# EAGLE board smoothieboard-0driver (EAGLE 6.4), part 1 of 2
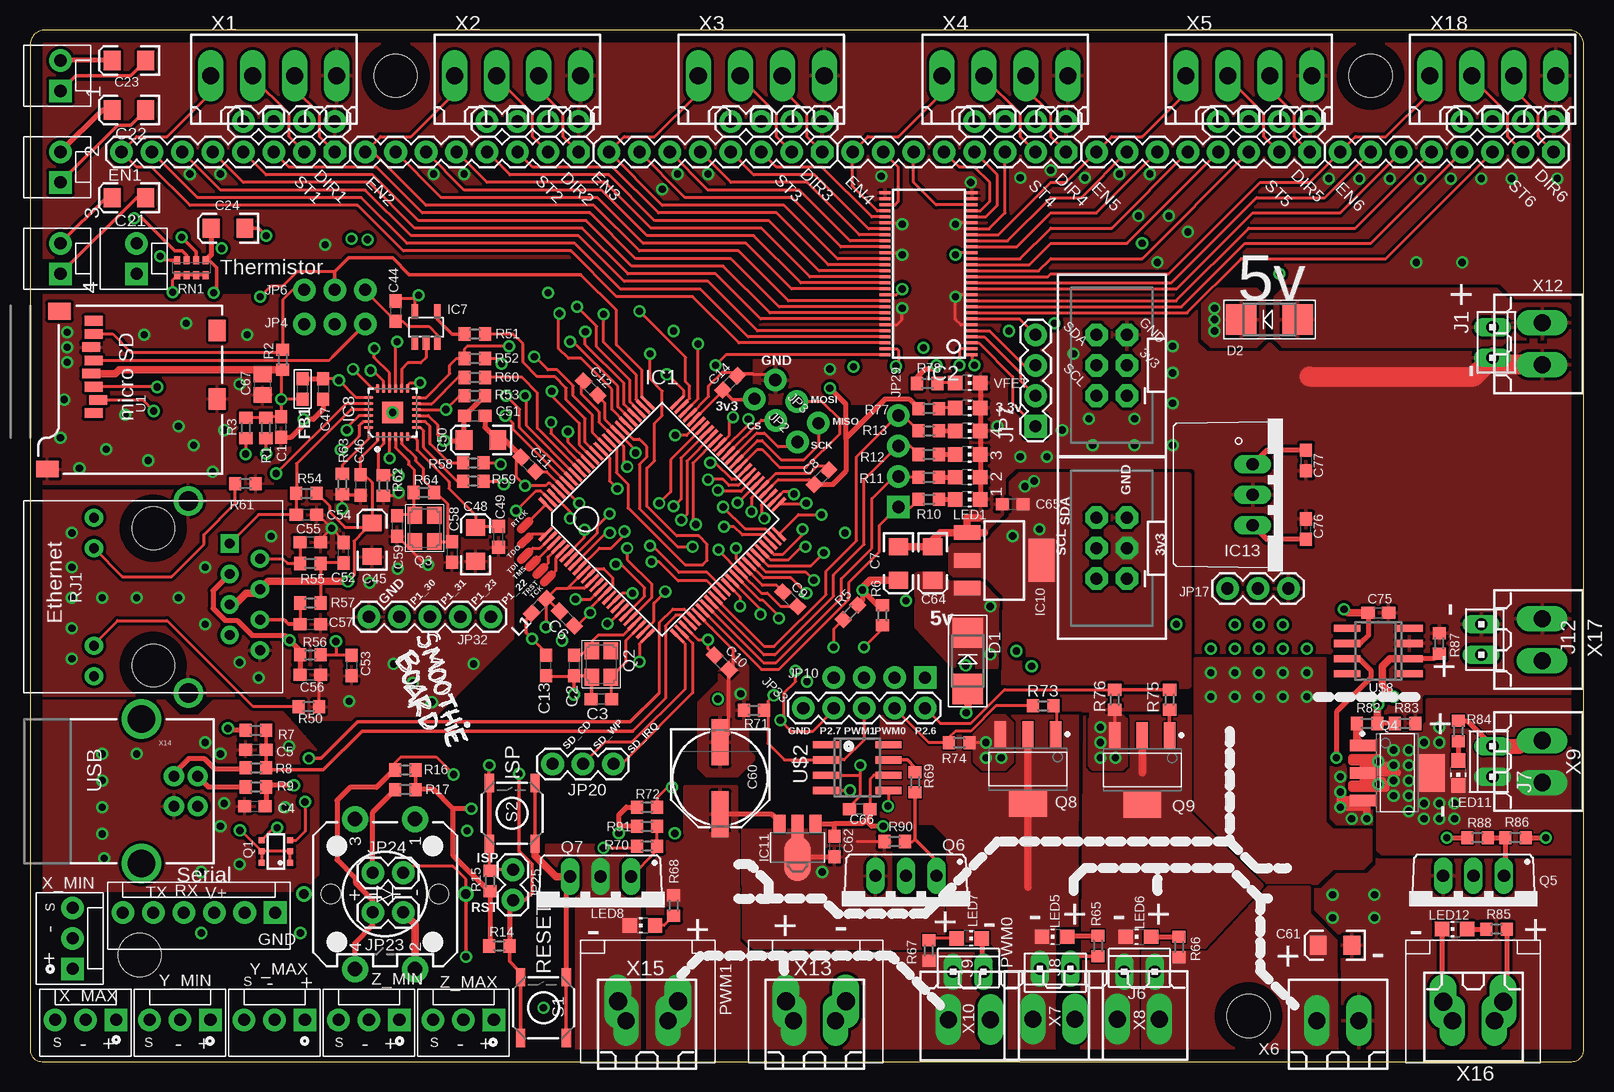
[diagram p4: board, top side]
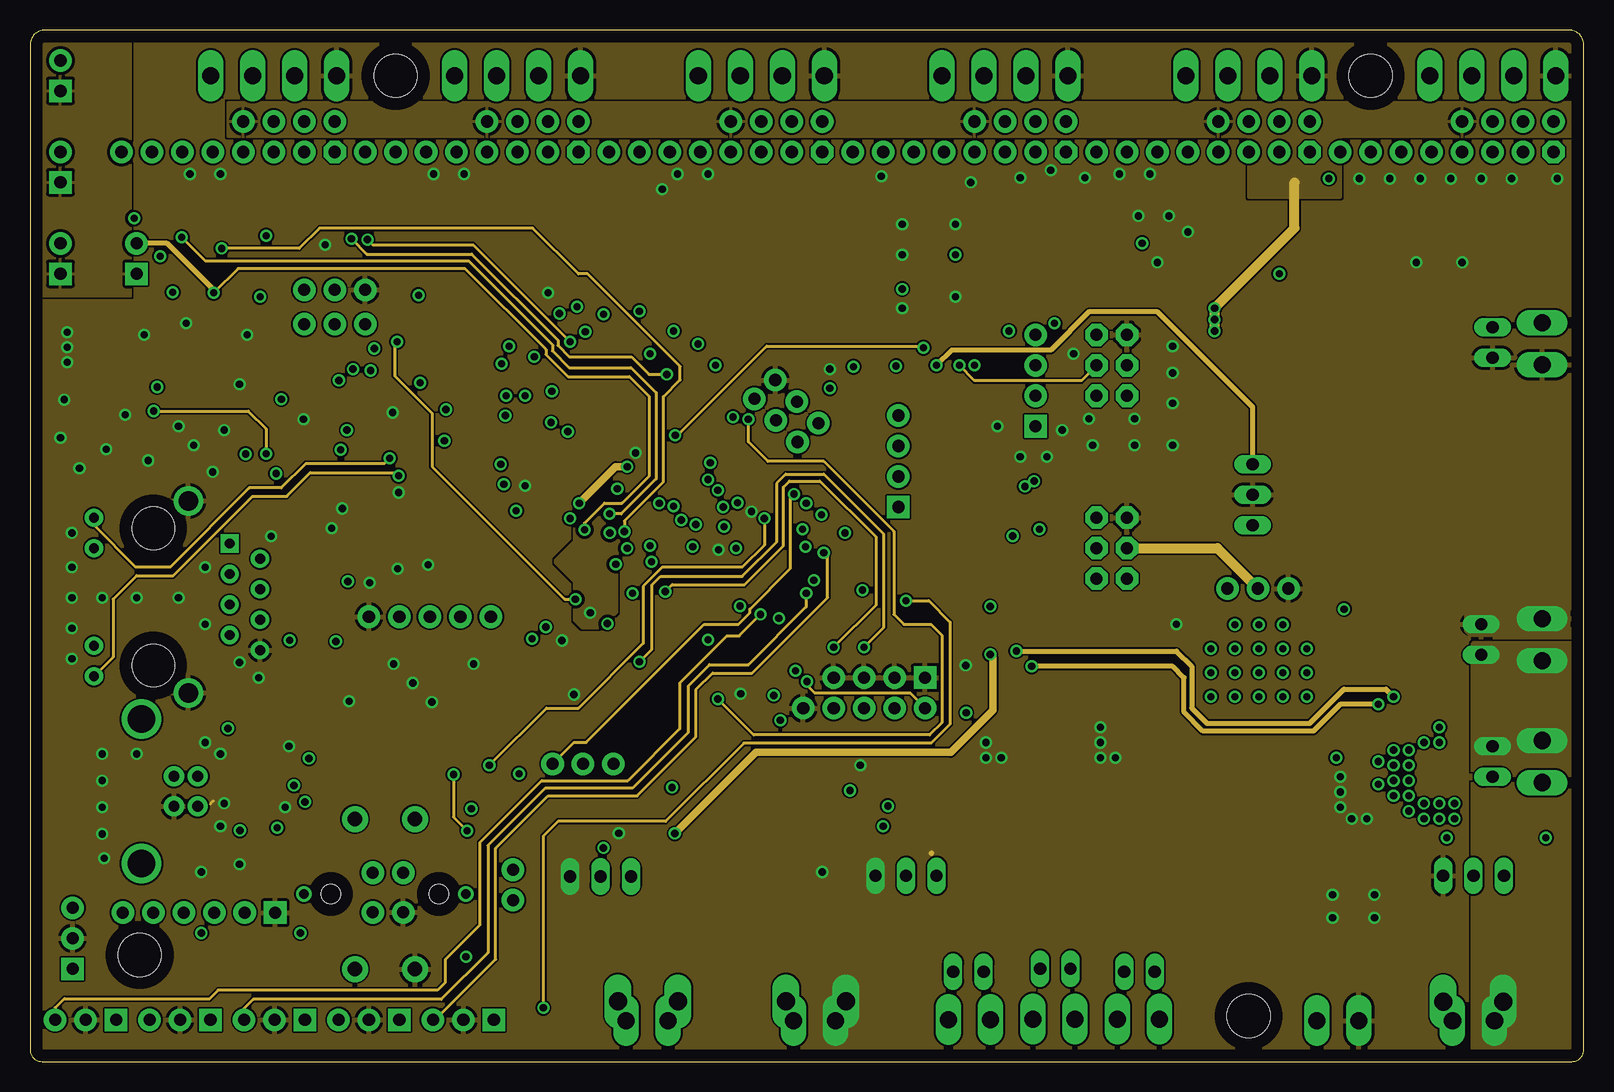
[diagram p5: board, inner layer Route2]
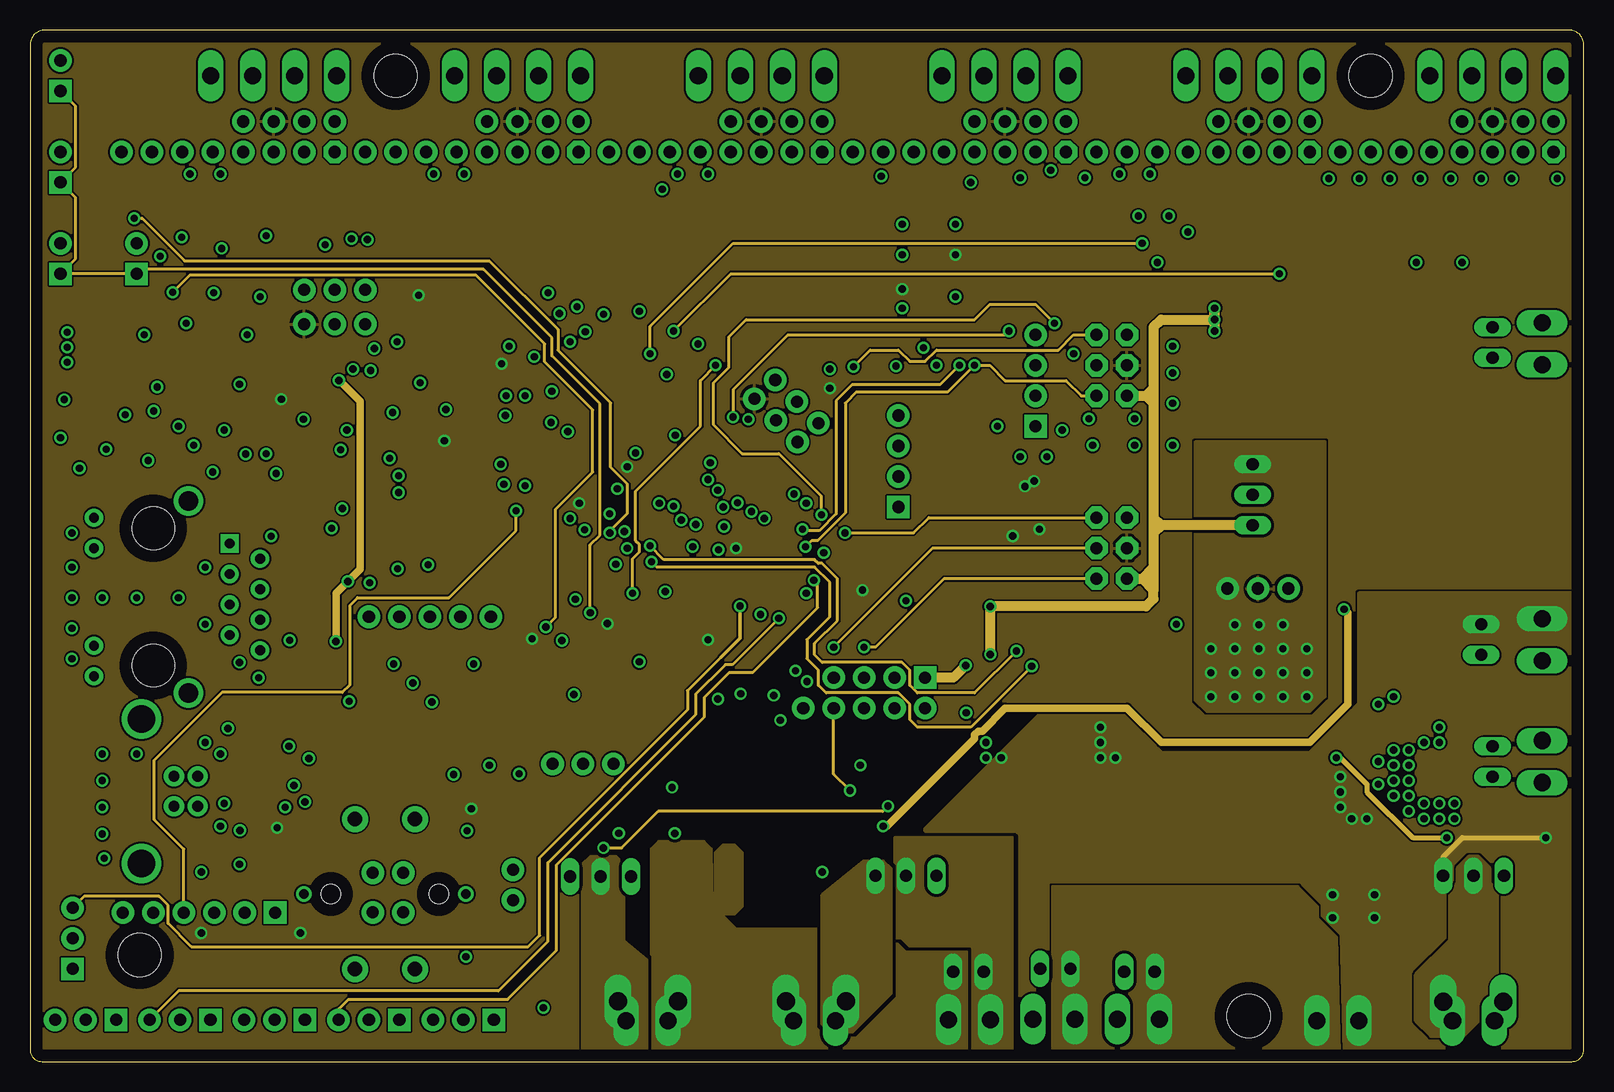
[diagram p6: board, inner layer Route15]
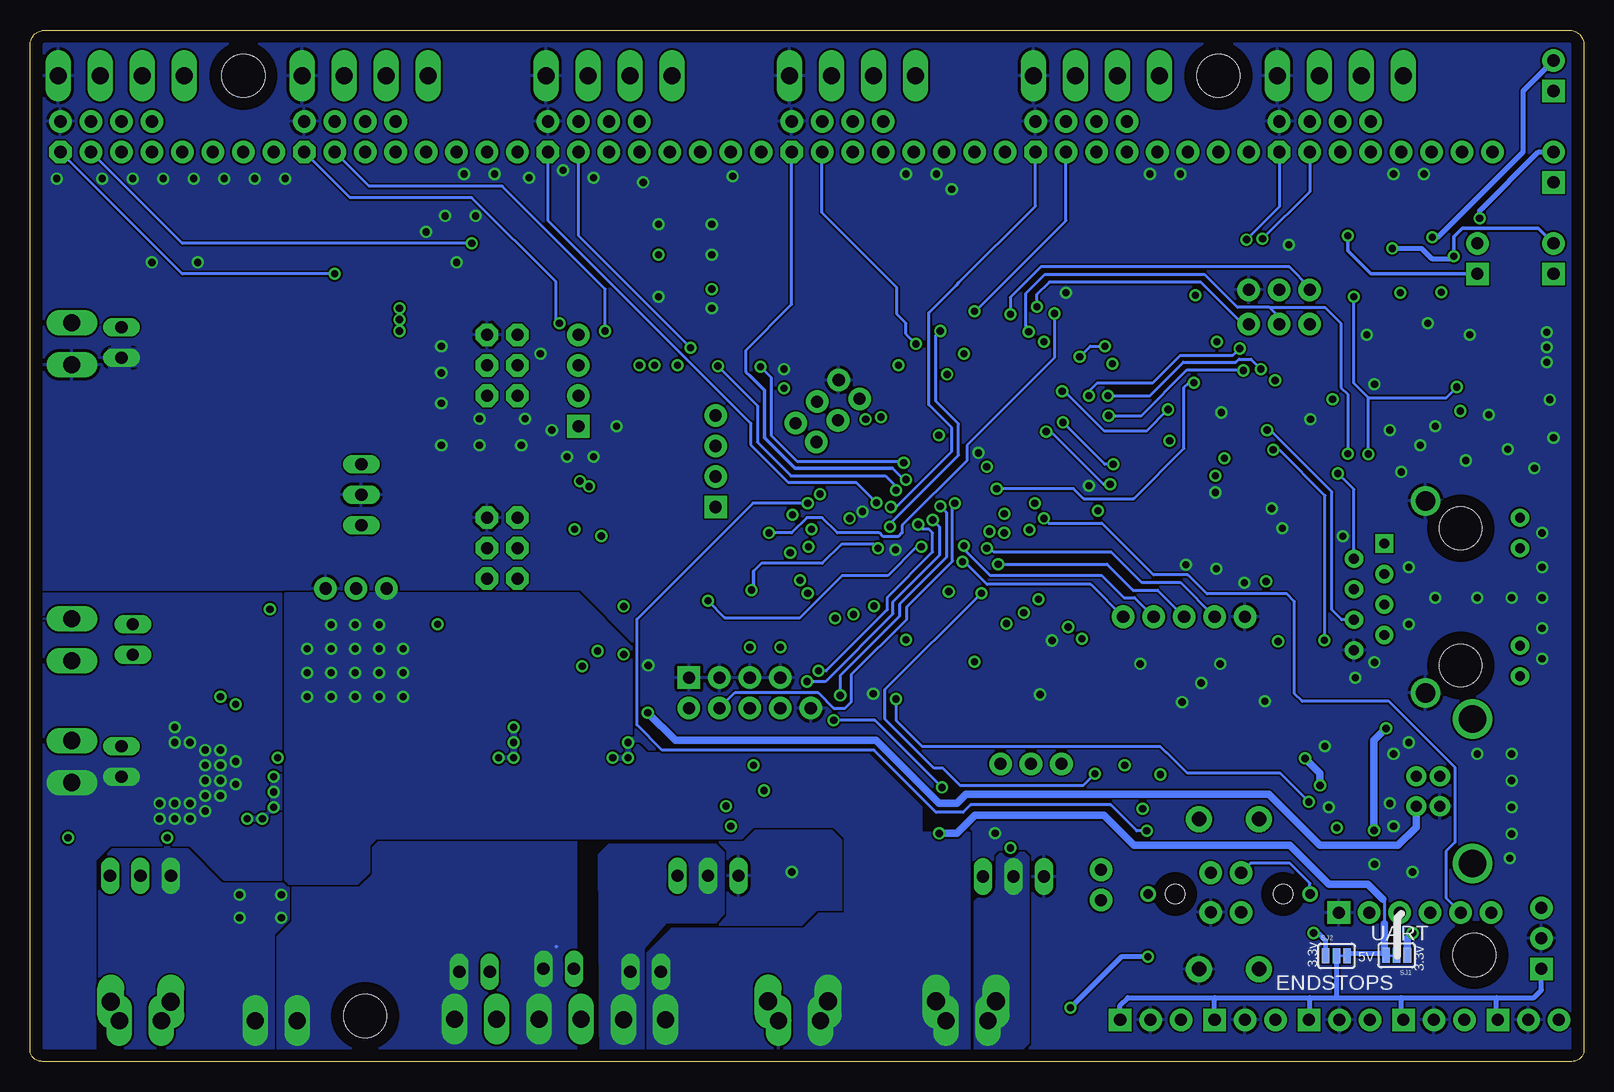
[diagram p7: board, bottom side, seen from below]

Size 129.54 x 85.96 mm. Coordinates in mm from the lower left corner, seen from the top.
Outline: 128.27,85.96 1.27,85.96 arc90 0,84.69 0,1 arc90 1,0 128.53,0 arc90 129.54,1 129.54,84.69 arc90 128.27,85.96
Copper layers (1*2+15*16): Top 0.035mm / dielectric 0.5mm / Route2 0.035mm / dielectric 0.5mm / Route15 0.035mm / dielectric 0.5mm / Bottom 0.035mm
Design rules "default *": minimum track width 10mil, minimum drill 12mil, track to track 6mil, track to pad 6mil, pad to pad 6mil, via to via 6mil, smd to smd 6mil, copper to edge 40mil, drill to drill 8mil, minimum pad ring 10mil, minimum via ring 8mil, stop-mask expansion 4mil, vias tented up to drill 0.61mm, thermal gap 10mil
Holes 3.6 mm at 111.76,82.15 30.48,82.15 9.14,8.87 101.6,3.79

## Footprints (pad centres in the part's own frame; a part is rotated, then mirrored left to right if it is on the bottom)
C0603 = smd 1.1 x 1: 1 -0.85,0; 2 0.85,0
EIA3216 = smd 1.4 x 1.6: A 1.4,0; C -1.4,0
C0603K = smd 1.05 x 1.08: 1 -0.875,0; 2 0.875,0
PANASONIC_E = smd 3.8 x 1.4: + 3,0; - -3,0
C0805 = smd 1.3 x 1.5: 1 -0.85,0; 2 0.85,0
SMADIODE = smd 2.54 x 2.54: A 2.349,0; C -2.349,0
0603 = smd 1.1 x 1: 1 -0.85,0; 2 0.85,0
LQFP100 = smd 0.27 x 1.5: 1 -6,-7.75; 2 -5.5,-7.75; 3 -5,-7.75; 4 -4.5,-7.75; 5 -4,-7.75; 6 -3.5,-7.75; 7 -3,-7.75; 8 -2.5,-7.75; 9 -2,-7.75; 10 -1.5,-7.75; 11 -1,-7.75; 12 -0.5,-7.75; 13 0,-7.75; 14 0.5,-7.75; 15 1,-7.75; 16 1.5,-7.75; 17 2,-7.75; 18 2.5,-7.75; 19 3,-7.75; 20 3.5,-7.75; 21 4,-7.75; 22 4.5,-7.75; 23 5,-7.75; 24 5.5,-7.75; 25 6,-7.75; 51 6,7.75; 52 5.5,7.75; 53 5,7.75; 54 4.5,7.75; 55 4,7.75; 56 3.5,7.75; 57 3,7.75; 58 2.5,7.75; 59 2,7.75; 60 1.5,7.75; 61 1,7.75; 62 0.5,7.75; 63 0,7.75; 64 -0.5,7.75; 65 -1,7.75; 66 -1.5,7.75; 67 -2,7.75; 68 -2.5,7.75; 69 -3,7.75; 70 -3.5,7.75; 71 -4,7.75; 72 -4.5,7.75; 73 -5,7.75; 74 -5.5,7.75; 75 -6,7.75 | smd 1.5 x 0.27: 26 7.75,-6; 27 7.75,-5.5; 28 7.75,-5; 29 7.75,-4.5; 30 7.75,-4; 31 7.75,-3.5; 32 7.75,-3; 33 7.75,-2.5; 34 7.75,-2; 35 7.75,-1.5; 36 7.75,-1; 37 7.75,-0.5; 38 7.75,0; 39 7.75,0.5; 40 7.75,1; 41 7.75,1.5; 42 7.75,2; 43 7.75,2.5; 44 7.75,3; 45 7.75,3.5; 46 7.75,4; 47 7.75,4.5; 48 7.75,5; 49 7.75,5.5; 50 7.75,6; 76 -7.75,6; 77 -7.75,5.5; 78 -7.75,5; 79 -7.75,4.5; 80 -7.75,4; 81 -7.75,3.5; 82 -7.75,3; 83 -7.75,2.5; 84 -7.75,2; 85 -7.75,1.5; 86 -7.75,1; 87 -7.75,0.5; 88 -7.75,0; 89 -7.75,-0.5; 90 -7.75,-1; 91 -7.75,-1.5; 92 -7.75,-2; 93 -7.75,-2.5; 94 -7.75,-3; 95 -7.75,-3.5; 96 -7.75,-4; 97 -7.75,-4.5; 98 -7.75,-5; 99 -7.75,-5.5; 100 -7.75,-6
TSSOP56-6 = smd 0.254 x 0.9: 1 -6.75,-3.6; 2 -6.25,-3.6; 3 -5.75,-3.6; 4 -5.25,-3.6; 5 -4.75,-3.6; 6 -4.25,-3.6; 7 -3.75,-3.6; 8 -3.25,-3.6; 9 -2.75,-3.6; 10 -2.25,-3.6; 11 -1.75,-3.6; 12 -1.25,-3.6; 13 -0.75,-3.6; 14 -0.25,-3.6; 15 0.25,-3.6; 16 0.75,-3.6; 17 1.25,-3.6; 18 1.75,-3.6; 19 2.25,-3.6; 20 2.75,-3.6; 21 3.25,-3.6; 22 3.75,-3.6; 23 4.25,-3.6; 24 4.75,-3.6; 25 5.25,-3.6; 26 5.75,-3.6; 27 6.25,-3.6; 28 6.75,-3.6; 29 6.75,3.66; 30 6.25,3.66; 31 5.75,3.66; 32 5.25,3.66; 33 4.75,3.66; 34 4.25,3.66; 35 3.75,3.66; 36 3.25,3.66; 37 2.75,3.66; 38 2.25,3.66; 39 1.75,3.66; 40 1.25,3.66; 41 0.75,3.66; 42 0.25,3.66; 43 -0.25,3.66; 44 -0.75,3.66; 45 -1.25,3.66; 46 -1.75,3.66; 47 -2.25,3.66; 48 -2.75,3.66; 49 -3.25,3.66; 50 -3.75,3.66; 51 -4.25,3.66; 52 -4.75,3.66; 53 -5.25,3.66; 54 -5.75,3.66; 55 -6.25,3.66; 56 -6.75,3.66
SOT23-5 = smd 0.55 x 1.2: 1 -0.95,-1.3; 2 0,-1.3; 3 0.95,-1.3; 4 0.95,1.3; 5 -0.95,1.3
QFN24_4MM = smd 0.8 x 0.28: 1 -2,1.25; 2 -2,0.75; 3 -2,0.25; 4 -2,-0.25; 5 -2,-0.75; 6 -2,-1.25; 13 2,-1.25; 14 2,-0.75; 15 2,-0.25; 16 2,0.25; 17 2,0.75; 18 2,1.25 | smd 0.28 x 0.8: 7 -1.25,-2; 8 -0.75,-2; 9 -0.25,-2; 10 0.25,-2; 11 0.75,-2; 12 1.25,-2; 19 1.25,2; 20 0.75,2; 21 0.25,2; 22 -0.25,2; 23 -0.75,2; 24 -1.25,2 | smd 1.778 x 1.778: THERM 0,0
SOT223 = smd 1.219 x 2.235: 1 -2.311,-3.099; 2 0,-3.099; 3 2.311,-3.099 | smd 3.6 x 2.2: 4 0,3.099
SOT89 = smd 1 x 1.5: 1 -1.499,-1.981; 3 1.499,-1.981 | smd 1 x 2: 2 0,-1.727 | smd 2.2 x 3.7: 2@1 0,0.94
R-78 = drill 1.016 long: 1 -2.54,-2.54; 2 0,-2.54; 3 2.54,-2.54
10X02MTA = drill 1.016 long: 1 1.27,0; 2 -1.27,0
2X3-SHROUDED = drill 1.016 pad 1.88 octagon: 1 -1.27,2.54; 2 1.27,2.54; 3 -1.27,0; 4 1.27,0; 5 -1.27,-2.54; 6 1.27,-2.54
1X03_NO_SILK = drill 1.016 pad 1.88: 1 0,0; 2 2.54,0; 3 5.08,0
MOLEX-1X6 = drill 1.016 pad 1.88 square: 1 0,0 | drill 1.016 pad 1.88: 2 2.54,0; 3 5.08,0; 4 7.62,0; 5 10.16,0; 6 12.7,0
1X04 = drill 1.016 pad 1.88 square: 1 0,0 | drill 1.016 pad 1.88: 2 2.54,0; 3 5.08,0; 4 7.62,0
MOLEX-1X2 = drill 1.016 pad 1.88 square: 1 0,0 | drill 1.016 pad 1.88: 2 2.54,0
1X04_NO_SILK = drill 1.016 pad 1.88 square: 1 0,0 | drill 1.016 pad 1.88: 2 2.54,0; 3 5.08,0; 4 7.62,0
MOLEX-1X3 = drill 1.016 pad 1.88 square: 1 0,0 | drill 1.016 pad 1.88: 2 2.54,0; 3 5.08,0
1X03 = drill 1.016 pad 1.88: 1 0,0; 2 2.54,0; 3 5.08,0
1X02 = drill 1.016 pad 1.88: 1 0,0; 2 2.54,0
1X05 = drill 1.016 pad 1.88: 1 0,0; 2 2.54,0; 3 5.08,0; 4 7.62,0; 5 10.16,0
CHIP-LED0805 = smd 1.2 x 1.2: A 0,-1.05; C 0,1.05
PAPILIO-WING-8BIT = drill 1.016 pad 1.88 octagon: 1 0,0 | drill 1.016 pad 1.88: 2 0,2.54; 3 0,5.08; 4 0,7.62; 5 0,10.16; 6 0,12.7; 7 0,15.24; 8 0,17.78; 9 2.54,0; 10 2.54,2.54; 11 2.54,5.08; 12 2.54,7.62
SC74_INFINEON = smd 0.5 x 0.5: 1 -0.95,-1.2; 2 0,-1.2; 3 0.95,-1.2; 4 0.95,1.2; 5 0,1.2; 6 -0.95,1.2
CRYSTAL_3.2X2.5 = smd 1.4 x 1.2: 1 -1.1,-0.8; 2 1.1,0.8; GND1 -1.1,0.8; GND2 1.1,-0.8
SOT230P700X160-4N = smd 2.15 x 0.95: 1 -2.9,2.3; 2 -2.9,0; 3 -2.9,-2.3 | smd 2.15 x 3.15: 4 2.9,0
TO220BV = drill 1.016 long: D 0,-2.54; G -2.54,-2.54; S 2.54,-2.54
R0603 = smd 1 x 1.1: 1 -0.85,0; 2 0.85,0
HR911105A = drill 0.813 pad 1.524: G+ 4.953,-6.604; G- 4.953,-4.064; GND -8.89,4.445; NC -6.35,3.175; P4 -8.89,-0.635; P5 -6.35,0.635; RD+ -6.35,-1.905; RD- -8.89,1.905; TD- -8.89,-3.175; Y+ 4.953,6.604; Y- 4.953,4.064 | drill 1.651 pad 2.159: SHIELD0 -2.921,8.001; SHIELD1 -2.921,-8.001 | drill 0.813 pad 1.524 square: TD+ -6.35,-4.445 | hole 3.556: 0,-5.715; 0,5.715
0603-ARV = smd 0.5 x 0.65: 1 -1.2,-0.625; 2 -0.4,-0.625; 3 0.4,-0.625; 4 1.2,-0.625; 5 1.2,0.625; 6 0.4,0.625; 7 -0.4,0.625; 8 -1.2,0.625
TACTILE_SWITCH_SMD = smd 1.524 x 0.762: 1 -2.54,1.905; 2 2.54,1.905; 3 -2.54,-1.905; 4 2.54,-1.905
TACTILE-PTH-LED-12MM = drill 1.2 pad 2.159: 1 -6.25,2.5; 2 6.25,2.5; 3 -6.25,-2.5; 4 6.25,-2.5 | drill 0.8: A 0,6.75; C 0,-6.75 | hole 1.6: 0,4.5; 0,-4.5
SJ_3 = smd 0.635 x 1.27: 1 -0.889,0; 2 0,0; 3 0.889,0
MICRO-SD-SOCKET-PP = smd 0.8 x 1.5: 1 -8.94,10.7; 2 -7.84,10.3; 3 -6.74,10.7; 4 -5.64,10.9; 5 -4.54,10.7; 6 -3.44,10.9; 7 -2.34,10.7; 8 -1.24,10.7 | smd 1.8 x 1.4: CD1 -2.05,0.4; CD2 -7.75,0.4 | smd 1.4 x 1.9: GND1 -13.6,14.55; GND3 -0.45,13.55
SOIC8 = smd 0.6 x 2.2: 1 -1.905,-2.6; 2 -0.635,-2.6; 3 0.635,-2.6; 4 1.905,-2.6; 5 1.905,2.6; 6 0.635,2.6; 7 -0.635,2.6; 8 -1.905,2.6
1715250000 = drill 1.5 long: P$1 0,0; P$2 5,0
180-4 = drill 1.422 long: 1 -5.25,0; 2 -1.75,0; 3 1.75,0; 4 5.25,0
180G-2 = drill 1.422 long: 1 -1.75,0; 2 1.75,0
USB-B-PTH = drill 0.914 pad 1.676: D+ 0,1.25; D- 1.981,1.25; GND 0,-1.25; VBUS 1.981,-1.25 | drill 2.286: S1 -2.718,-6.02; S2 -2.718,6.02

## Placement (x,y rotation side)
C1  .1uF  [C0603]  20.95,52.88 90 top
C2  12pF  [C0603]  45.34,33 270 top
C3  12pF  [C0603]  47.62,30.21 180 top
C4  18pF  [C0603]  18.74,21.27 0 top
C5  18pF  [C0603]  18.83,26 0 top
C6  .1uF  [C0603]  44.74,36.92 315 top
C7  10uF  [EIA3216]  72.39,41.51 270 top
C8  .1uF  [C0603]  65.98,48.68 225 top
C9  .1uF  [C0603]  63.37,38.52 135 top
C10  .1uF  [C0603]  57.66,33.25 135 top
C11  .1uF  [C0603]  41.53,49.76 315 top
C12  .1uF  [C0603]  46.74,56.11 135 top
C13  .1uF  [C0603]  43,33.01 90 top
C14  .1uF  [C0603]  58.36,56.56 225 top
C21  10uF  [EIA3216]  8.26,71.99 180 top
C22  10uF  [EIA3216]  8.26,79.29 180 top
C23  10uF  [EIA3216]  8.26,83.42 180 top
C24  10uF  [EIA3216]  16.51,69.45 180 top
C44  .1uF  [C0603]  30.48,62.53 270 top
C45  10uF  [EIA3216]  28.51,43.48 90 top
C46  .1uF  [C0603]  27.56,48.05 270 top
C47  .1uF  [C0603]  24.45,56.05 270 top
C48  1uF  [EIA3216]  37.15,43.1 90 top
C49  470pF  [C0603K]  39.05,43.73 270 top
C50  10uF  [EIA3216]  37.59,51.8 180 top
C51  .1uF  [C0603]  37.08,53.83 0 top
C52  .1uF  [C0603]  26.16,42.4 90 top
C53  .1uF  [C0603]  26.8,33 270 top
C54  18pF  [C0603]  23.05,45.57 0 top
C55  18pF  [C0603]  23.37,43.29 0 top
C56  18pF  [C0603]  23.37,32.24 0 top
C57  18pF  [C0603]  23.37,36.43 0 top
C58  12pF  [C0603]  35.18,42.46 270 top
C59  12pF  [C0603]  30.61,44.62 270 top
C60  100uF  [PANASONIC_E]  57.53,23.6 270 top
C61  10uF  [EIA3216]  108.78,9.7 180 top
C62  .1uF  [C0603]  67.05,17.92 270 top
C64  10uF  [EIA3216]  75.25,41.51 270 top
C65  .1uF  [C0603]  81.91,46.42 180 top
C66  .1uF  [C0603]  69.17,21.04 180 top
C67  1uF  [C0805]  19.4,56.41 90 top
C75  .1uF  [C0603]  112.39,37.38 0 top
C76  .1uF  [C0603]  106.36,44.37 90 top
C77  .33uF  [C0603]  106.36,50.08 270 top
D1  MBRA210LT3  [SMADIODE]  78.17,33.38 270 top
D2  MBRA210LT3  [SMADIODE]  103.31,61.83 0 top
FB1  [0603]  22.73,56.05 90 top
IC1  LPC1769  [LQFP100]  52.7,45.19 315 top
IC2  PCA9505  [TSSOP56-6]  74.93,65.64 90 top
IC7  [SOT23-5]  33.02,61.19 0 top
IC8  [QFN24_4MM]  30.23,54.08 90 top
IC10  LM1117-3.3V  [SOT223]  81.22,41.76 270 top
IC11  78L12F  [SOT89]  63.98,17.84 180 top
IC13  R-78E-5.0  [R-78]  104.46,47.22 270 top
J1  [10X02MTA]  121.92,59.92 270 top
J6  [10X02MTA]  92.48,7.49 0 top
J7  [10X02MTA]  121.92,25 90 top
J8  [10X02MTA]  85.47,7.73 180 top
J9  [10X02MTA]  78.22,7.47 0 top
J12  [10X02MTA]  120.97,35.16 270 top
JP1  I2C  [2X3-SHROUDED]  90.17,58.02 180 top
JP2  [1X03_NO_SILK]  60.39,55.23 315 top
JP3  [1X03_NO_SILK]  65.72,53.19 135 top
JP4  [1X03_NO_SILK]  22.86,61.45 0 top
JP5  [MOLEX-1X6]  20.44,12.41 180 top
JP6  [1X03_NO_SILK]  22.86,64.31 0 top
JP7  [1X04]  83.82,52.94 90 top
JP9  [MOLEX-1X2]  2.54,65.64 90 top
JP10  [1X04_NO_SILK]  74.61,31.98 180 top
JP11  [MOLEX-1X2]  2.54,73.26 90 top
JP12  [MOLEX-1X2]  2.54,80.88 90 top
JP13  [MOLEX-1X2]  8.89,65.64 90 top
JP14  [MOLEX-1X3]  7.18,3.47 180 top
JP15  I2C  [2X3-SHROUDED]  90.17,42.78 180 top
JP16  [MOLEX-1X3]  15.05,3.47 180 top
JP17  [1X03]  99.82,39.41 0 top
JP19  [MOLEX-1X3]  22.92,3.47 180 top
JP20  [1X03]  48.64,24.81 180 top
JP21  [MOLEX-1X3]  30.8,3.47 180 top
JP22  [MOLEX-1X3]  38.67,3.47 180 top
JP23  [1X02]  28.57,12.43 0 top
JP24  [1X02]  28.57,15.73 0 top
JP25  [1X02]  40.26,13.44 90 top
JP26  [MOLEX-1X3]  3.56,7.73 90 top
JP29  [1X04_NO_SILK]  72.39,46.21 90 top
JP32  [1X05]  38.42,37.06 180 top
JP33  [1X05]  74.61,29.44 180 top
L1  [0603]  42.42,37.95 225 top
LED1  [CHIP-LED0805]  78.17,46.84 270 top
LED2  [CHIP-LED0805]  78.17,48.68 270 top
LED3  [CHIP-LED0805]  78.17,50.59 270 top
LED4  [CHIP-LED0805]  78.17,52.56 270 top
LED5  [CHIP-LED0805]  85.41,10.39 90 top
LED6  [CHIP-LED0805]  92.39,10.39 90 top
LED7  [CHIP-LED0805]  78.3,10.27 270 top
LED8  [CHIP-LED0805]  51.05,11.35 90 top
LED9  [CHIP-LED0805]  78.17,54.46 270 top
LED10  [CHIP-LED0805]  78.17,56.56 270 top
LED11  [CHIP-LED0805]  119.06,24.05 180 top
LED12  [CHIP-LED0805]  118.75,11.03 90 top
M1  PAPILIO-WING-8BIT  [PAPILIO-WING-8BIT]  25.4,75.8 90 top
M2  PAPILIO-WING-8BIT  [PAPILIO-WING-8BIT]  45.72,75.8 90 top
M3  PAPILIO-WING-8BIT  [PAPILIO-WING-8BIT]  66.04,75.8 90 top
M4  PAPILIO-WING-8BIT  [PAPILIO-WING-8BIT]  86.36,75.8 90 top
M5  PAPILIO-WING-8BIT  [PAPILIO-WING-8BIT]  106.68,75.8 90 top
M6  PAPILIO-WING-8BIT  [PAPILIO-WING-8BIT]  127,75.8 90 top
Q1  BSL207SP  [SC74_INFINEON]  20.5,17.51 90 top
Q2  12MHz  [CRYSTAL_3.2X2.5]  47.62,33.13 90 top
Q3  25MHz  [CRYSTAL_3.2X2.5]  32.89,44.43 270 top
Q4  ZXMN4A06  [SOT230P700X160-4N]  113.98,24.05 0 top
Q5  AOT240L  [TO220BV]  120.33,12.93 180 top
Q6  AOT240L  [TO220BV]  73.03,12.93 180 top
Q7  AOT240L  [TO220BV]  47.56,12.87 180 top
Q8  ZXMN4A06  [SOT230P700X160-4N]  83.19,24.36 270 top
Q9  ZXMN4A06  [SOT230P700X160-4N]  92.71,24.3 270 top
R1  10K  [R0603]  19.67,52.79 90 top
R2  10K  [R0603]  21.07,58.48 270 top
R3  10K  [R0603]  18,52.79 90 top
R5  2.2k  [R0603]  68.4,37.44 45 top
R6  2.2k  [R0603]  71.06,37.19 90 top
R7  1.5K  [R0603]  18.83,27.59 180 top
R8  33R  [R0603]  18.85,24.48 0 top
R9  33R  [R0603]  18.85,22.88 0 top
R10  1k  [R0603]  74.93,46.84 180 top
R11  1k  [R0603]  74.93,48.68 180 top
R12  1k  [R0603]  74.93,50.59 180 top
R13  1k  [R0603]  74.93,52.56 180 top
R14  10K  [R0603]  39.12,9.63 180 top
R15  10K  [R0603]  38.35,15.03 270 top
R16  10K  [R0603]  31.31,24.3 0 top
R17  330R  [R0603]  31.31,22.65 180 top
R50  330R  [R0603]  23.24,29.57 180 top
R51  22R  [R0603]  37.08,60.62 0 top
R52  1.5K  [R0603]  37.08,58.59 0 top
R53  10K  [R0603]  37.08,55.48 0 top
R54  49.9R  [R0603]  23.05,47.35 180 top
R55  49.9R  [R0603]  23.37,41.51 180 top
R56  49.9R  [R0603]  23.37,33.89 180 top
R57  49.9R  [R0603]  23.37,38.21 180 top
R58  22R  [R0603]  36.96,49.89 0 top
R59  22R  [R0603]  36.96,48.37 0 top
R60  22R  [R0603]  37.08,57 0 top
R61  330R  [R0603]  17.97,48.16 180 top
R62  10K  [R0603]  29.46,47.99 90 top
R63  12.1K  [R0603]  26.04,48.11 90 top
R64  1M  [R0603]  32.83,47.41 180 top
R65  5.6K  [R0603]  89.03,9.63 90 top
R66  5.6K  [R0603]  95.78,9.54 90 top
R67  5.6K  [R0603]  74.93,9.25 90 top
R68  5.6K  [R0603]  53.66,13 270 top
R69  22R  [R0603]  73.78,23.27 270 top
R70  22R  [R0603]  51.44,17.95 0 top
R71  10k  [R0603]  60.35,29.26 0 top
R72  10k  [R0603]  51.44,21.19 0 top
R73  22R  [R0603]  84.45,29.63 180 top
R74  10k  [R0603]  77.47,26.57 0 top
R75  22R  [R0603]  95,30.14 90 top
R76  10k  [R0603]  90.42,30.14 270 top
R77  1k  [R0603]  74.93,54.4 180 top
R78  2.2K  [R0603]  74.8,56.49 180 top
R82  22R  [R0603]  111.44,28.17 0 top
R83  10k  [R0603]  114.62,28.17 0 top
R84  5.6K  [R0603]  119.06,27.54 270 top
R85  5.6K  [R0603]  122.24,11.03 180 top
R86  10k  [R0603]  123.83,18.65 0 top
R87  10k  [R0603]  117.47,34.84 270 top
R88  22R  [R0603]  120.65,18.65 180 top
R90  10k  [R0603]  72.07,18.33 180 top
R91  10k  [R0603]  51.44,19.6 180 top
RJ1  HR911105A  [HR911105A]  10.29,38.71 180 top
RN1  4.7K  [0603-ARV]  13.46,66.15 0 top
S1  [TACTILE_SWITCH_SMD]  42.8,4.49 90 top
S2  [TACTILE_SWITCH_SMD]  40.2,20.68 90 top
S3  SWITCH-MOMENTARY-LEDPTH  [TACTILE-PTH-LED-12MM]  29.59,13.95 270 top
SJ1  [SJ_3]  15.62,8.85 180 bottom
SJ2  [SJ_3]  20.64,8.81 0 bottom
U1  USD-SOCKETNEW  [MICRO-SD-SOCKET-PP]  16,62.97 90 top
U$2  TC4427  [SOIC8]  68.96,24.49 270 top
U$5  5MMCONN  [1715250000]  63,5.01 0 top
U$6  5MMCONN  [1715250000]  49,5.01 0 top
U$7  5MMCONN  [1715250000]  117.79,5 0 top
U$8  TC4427  [SOIC8]  112.39,34.21 90 top
X1  [180-4]  20.32,82.15 0 top
X2  [180-4]  40.64,82.15 0 top
X3  [180-4]  60.96,82.15 0 top
X4  [180-4]  81.28,82.15 0 top
X5  [180-4]  101.6,82.15 0 top
X6  [180G-2]  109.03,3.41 0 top
X7  [180G-2]  85.34,3.54 180 top
X8  [180G-2]  92.38,3.54 180 top
X9  [180G-2]  126.05,25 270 top
X10  [180G-2]  78.33,3.49 180 top
X12  [180G-2]  126.05,59.8 270 top
X13  [180G-2]  65.41,3.41 0 top
X14  USBPTH  [USB-B-PTH]  12,22.51 0 top
X15  [180G-2]  51.44,3.41 0 top
X16  [180G-2]  120.33,3.41 180 top
X17  [180G-2]  126.05,35.16 270 top
X18  [180-4]  121.92,82.15 0 top